# EAGLE schematic cpb-dslr-remote-shield (EAGLE 7.7.0)
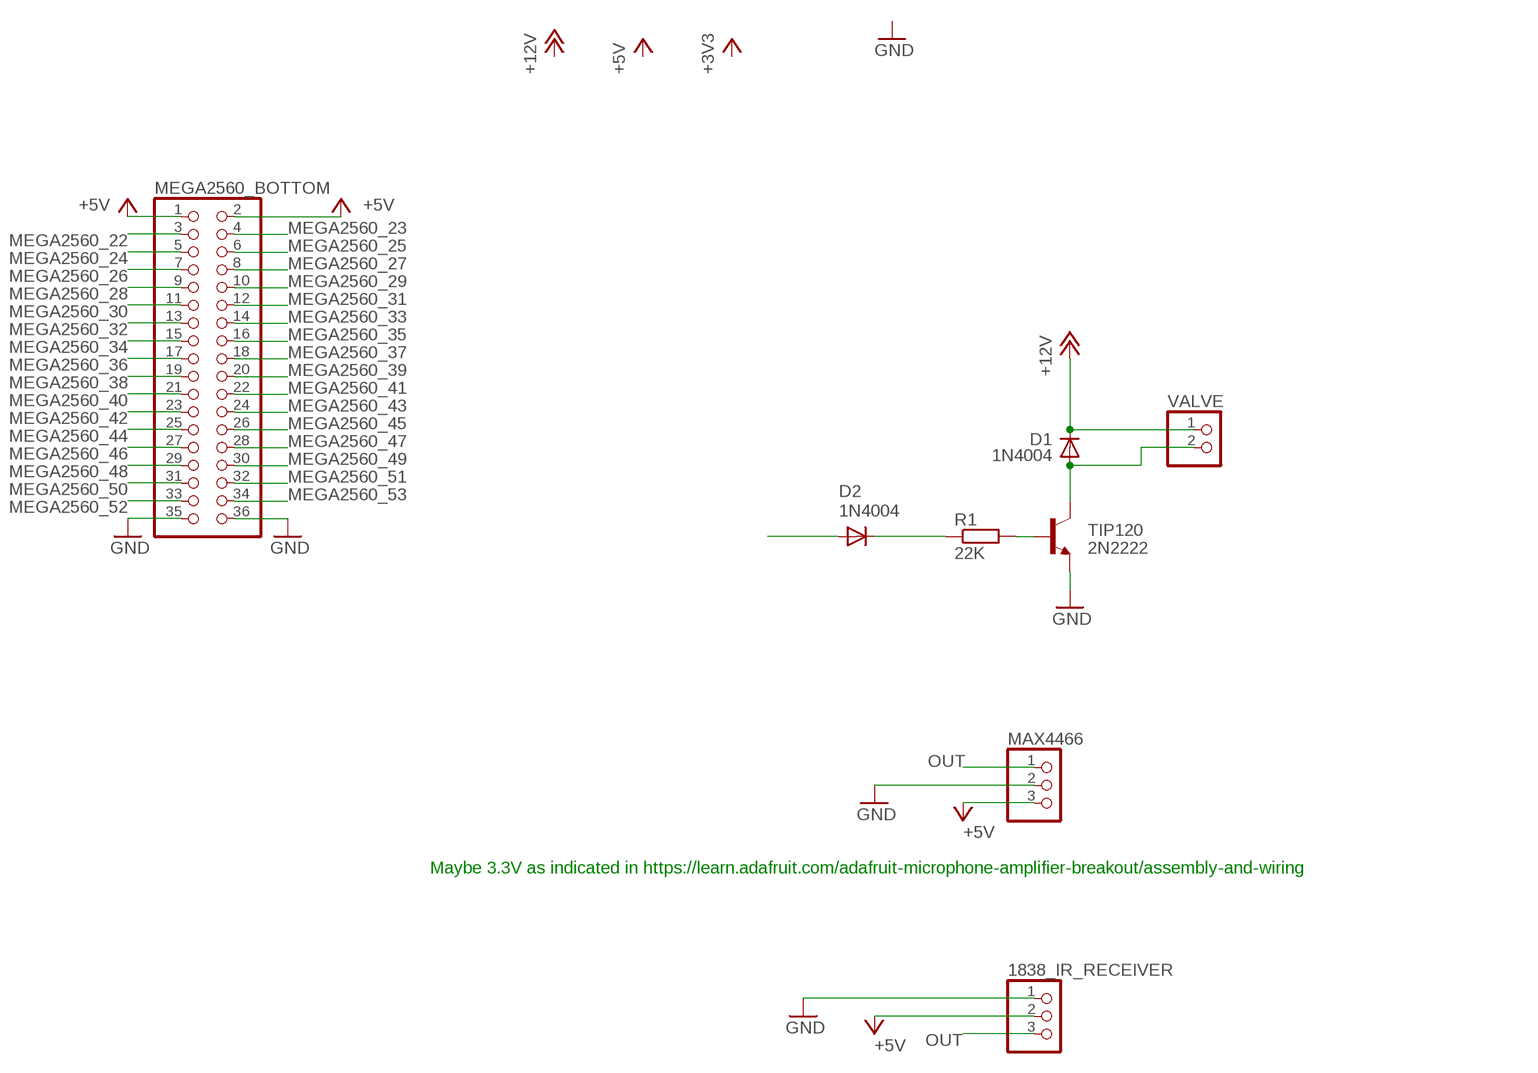
[diagram p0: schematic, sheet 1]

## Parts
1838_IR_RECEIVER  PINHD-1X3  [1X03]
D1  1N4004  [DO41-10]
D2  1N4004  [DO41-10]
MAX4466  PINHD-1X3  [1X03]
MEGA2560_BOTTOM  PINHD-2X18  [2X18]
R1  22K  R-EU_R0603  [R0603]
TIP120  2N2222  [TO92-EBC-OVAL]
VALVE  PINHD-1X2  [1X02]

## Nets
+5V: 1838_IR_RECEIVER.2 MAX4466.3 MEGA2560_BOTTOM.1 MEGA2560_BOTTOM.2
+12V: D1.C VALVE.1
GND: 1838_IR_RECEIVER.1 MAX4466.2 MEGA2560_BOTTOM.35 MEGA2560_BOTTOM.36 TIP120.E
MEGA2560_22: MEGA2560_BOTTOM.3
MEGA2560_23: MEGA2560_BOTTOM.4
MEGA2560_24: MEGA2560_BOTTOM.5
MEGA2560_25: MEGA2560_BOTTOM.6
MEGA2560_26: MEGA2560_BOTTOM.7
MEGA2560_27: MEGA2560_BOTTOM.8
MEGA2560_28: MEGA2560_BOTTOM.9
MEGA2560_29: MEGA2560_BOTTOM.10
MEGA2560_30: MEGA2560_BOTTOM.11
MEGA2560_31: MEGA2560_BOTTOM.12
MEGA2560_32: MEGA2560_BOTTOM.13
MEGA2560_33: MEGA2560_BOTTOM.14
MEGA2560_34: MEGA2560_BOTTOM.15
MEGA2560_35: MEGA2560_BOTTOM.16
MEGA2560_36: MEGA2560_BOTTOM.17
MEGA2560_37: MEGA2560_BOTTOM.18
MEGA2560_38: MEGA2560_BOTTOM.19
MEGA2560_39: MEGA2560_BOTTOM.20
MEGA2560_40: MEGA2560_BOTTOM.21
MEGA2560_41: MEGA2560_BOTTOM.22
MEGA2560_42: MEGA2560_BOTTOM.23
MEGA2560_43: MEGA2560_BOTTOM.24
MEGA2560_44: MEGA2560_BOTTOM.25
MEGA2560_45: MEGA2560_BOTTOM.26
MEGA2560_46: MEGA2560_BOTTOM.27
MEGA2560_47: MEGA2560_BOTTOM.28
MEGA2560_48: MEGA2560_BOTTOM.29
MEGA2560_49: MEGA2560_BOTTOM.30
MEGA2560_50: MEGA2560_BOTTOM.31
MEGA2560_51: MEGA2560_BOTTOM.32
MEGA2560_52: MEGA2560_BOTTOM.33
MEGA2560_53: MEGA2560_BOTTOM.34
N$1: D1.A TIP120.C VALVE.2
N$2: R1.2 TIP120.B
N$3: D2.C R1.1
N$4: D2.A
OUT: 1838_IR_RECEIVER.3 MAX4466.1

## Notes on the sheet
- Maybe 3.3V as indicated in https://learn.adafruit.com/adafruit-microphone-amplifier-breakout/assembly-and-wiring

## Library data of the parts
1838_IR_RECEIVER MAX4466 = pinhead:PINHD-1X3: PIN HEADER
D1 D2 = adafruit:1N4004: DIODE General purpose 1N400x type rectifier (With bigger pads) http://www.ladyada.net/library/pcb/eaglelibrary.html
MEGA2560_BOTTOM = pinhead:PINHD-2X18: PIN HEADER
R1 = resistor:R-EU_: RESISTOR, European symbol
TIP120 = adafruit:2N2222: NPN TRANSISTOR Big oval pads
VALVE = pinhead:PINHD-1X2: PIN HEADER